# Altium schematic sheet I2C_Switch_EEPROM.SchDoc: I²C Switch & EEPROM
size B; CheckedBy: Jason Sullins; Author: Jordan Harris-Toovy; Revision: 0.2; SheetNumber: 5; SheetTotal: 22; Size: ANSI B
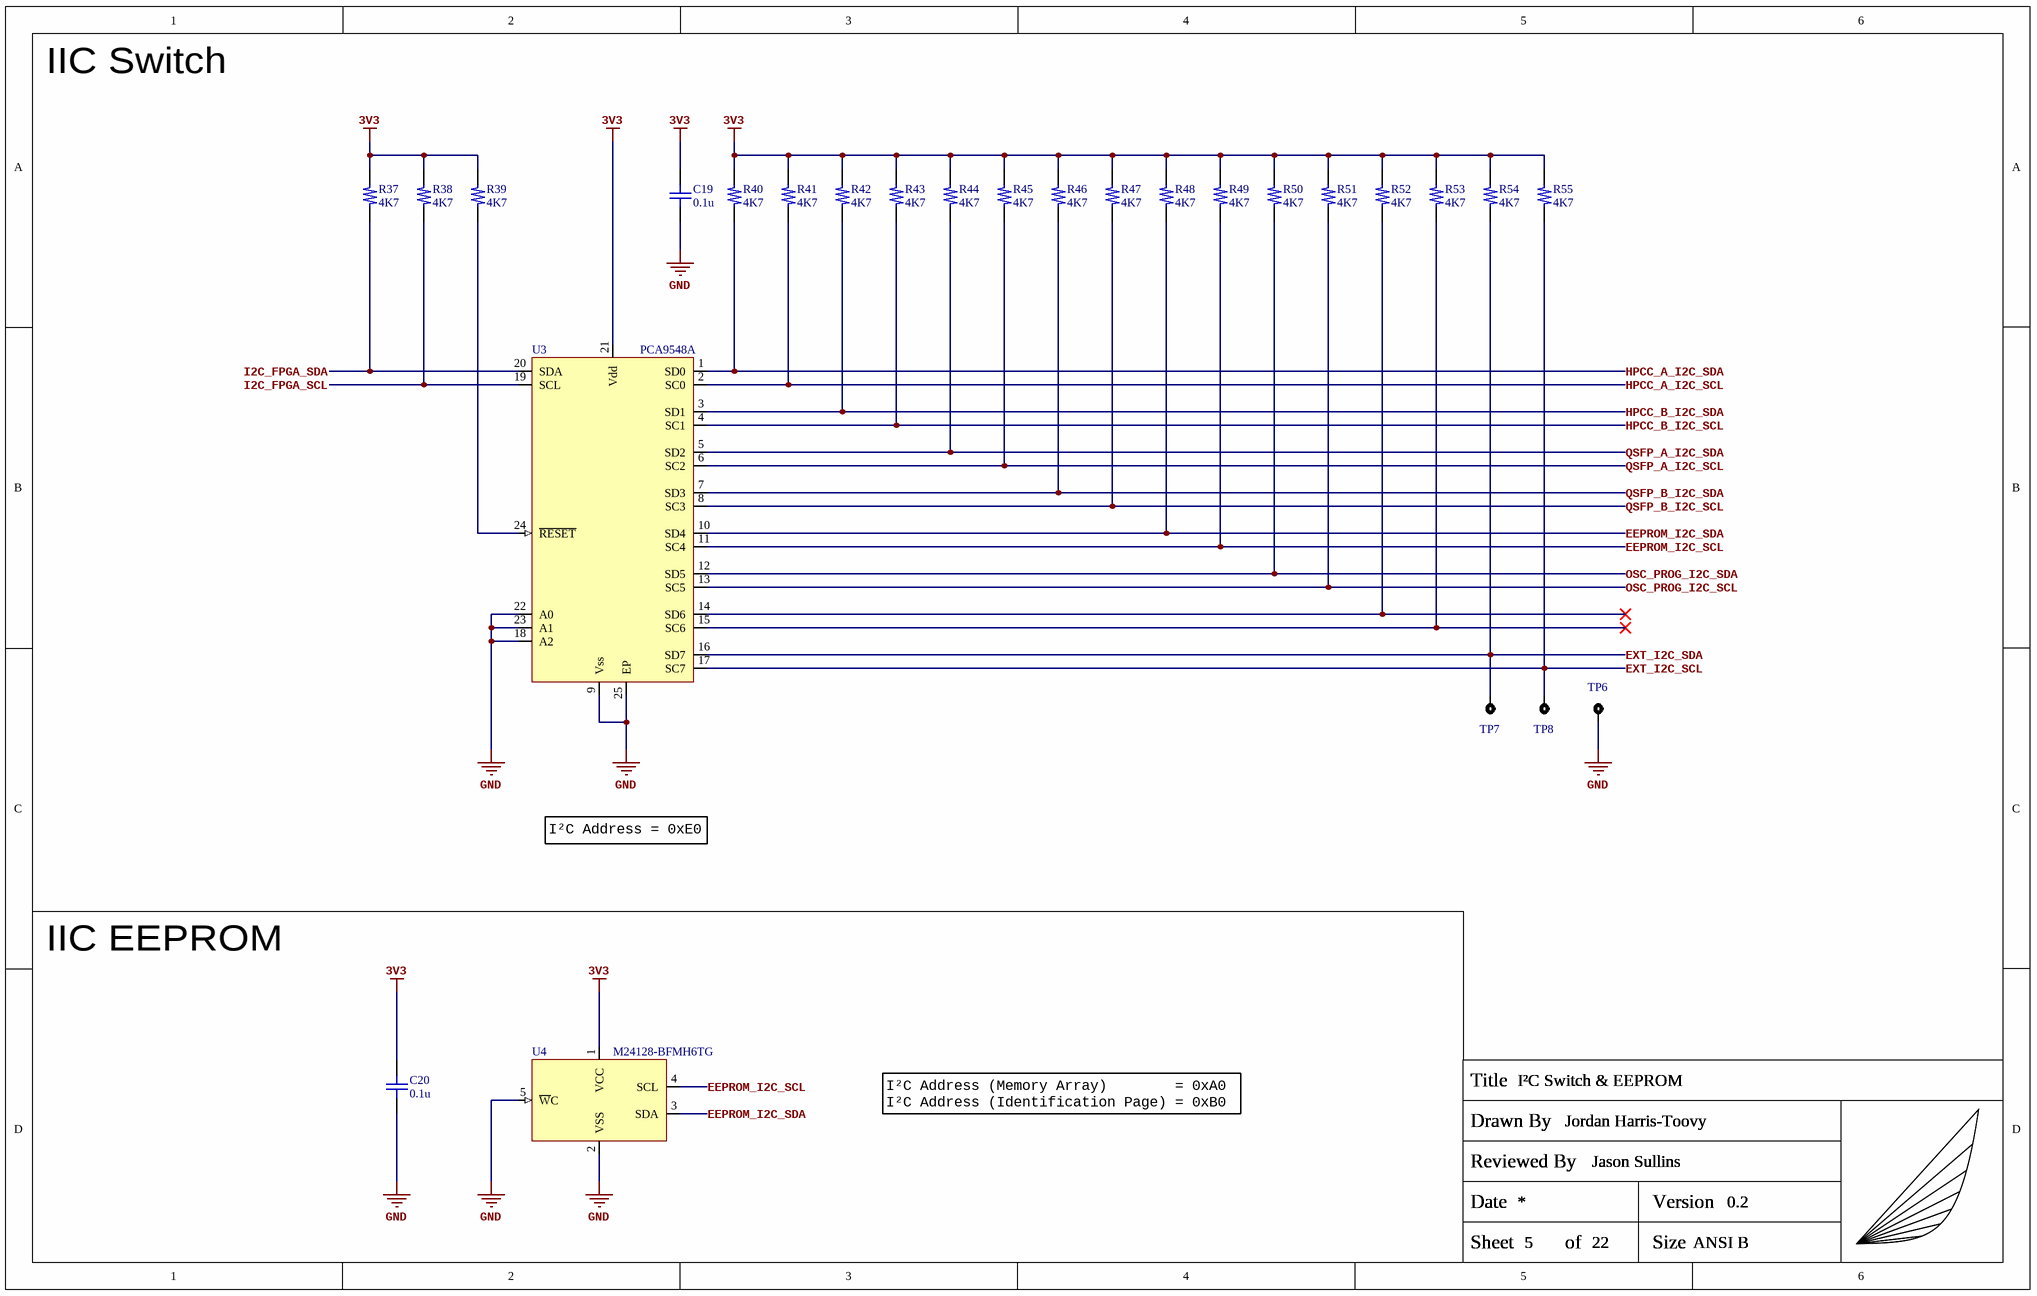
[diagram p0: I2C_Switch_EEPROM.SchDoc]

## Parts
C19  0.1u  [C_0402_Generic]
C20  0.1u  [C_0402_Generic]
R37  4K7  [R_0402_Generic]
R38  4K7  [R_0402_Generic]
R39  4K7  [R_0402_Generic]
R40  4K7  [R_0402_Generic]
R41  4K7  [R_0402_Generic]
R42  4K7  [R_0402_Generic]
R43  4K7  [R_0402_Generic]
R44  4K7  [R_0402_Generic]
R45  4K7  [R_0402_Generic]
R46  4K7  [R_0402_Generic]
R47  4K7  [R_0402_Generic]
R48  4K7  [R_0402_Generic]
R49  4K7  [R_0402_Generic]
R50  4K7  [R_0402_Generic]
R51  4K7  [R_0402_Generic]
R52  4K7  [R_0402_Generic]
R53  4K7  [R_0402_Generic]
R54  4K7  [R_0402_Generic]
R55  4K7  [R_0402_Generic]
TITLEBLOCK?  Capstone_Title_Block  (value not drawn)  (graphical)
TP6  EXT I2C GND Test Point  [TP_3MM]  (value not drawn)
TP7  EXT I2C SDA Test Point  [TP_3MM]  (value not drawn)
TP8  EXT I2C SCL Test Point  [TP_3MM]  (value not drawn)
U3  PCA9548A  [HVQFN24_NXP]
U4  M24128-BFMH6TG  [STM_DFN5]

## Nets
3V3: C19.2 C20.2 R37.2 R38.2 R39.2 R40.2 R41.2 R42.2 R43.2 R44.2 R45.2 R46.2 R47.2 R48.2 R49.2 R50.2 R51.2 R52.2 R53.2 R54.2 R55.2 U3.21(Vdd) U4.1(VCC)
GND: C19.1 C20.1 TP6.1 U3.9(Vss) U3.18(A2) U3.22(A0) U3.23(A1) U3.25(EP) U4.2(VSS) U4.5(~{W}C)
EEPROM_I2C_SCL: R49.1 U3.11(SC4) U4.4(SCL)
EEPROM_I2C_SDA: R48.1 U3.10(SD4) U4.3(SDA)
EXT_I2C_SCL: R55.1 TP8.1 U3.17(SC7)
EXT_I2C_SDA: R54.1 TP7.1 U3.16(SD7)
HPCC_A_I2C_SCL: R41.1 U3.2(SC0)
HPCC_A_I2C_SDA: R40.1 U3.1(SD0)
HPCC_B_I2C_SCL: R43.1 U3.4(SC1)
HPCC_B_I2C_SDA: R42.1 U3.3(SD1)
I2C_FPGA_SCL: R38.1 U3.19(SCL)
I2C_FPGA_SDA: R37.1 U3.20(SDA)
OSC_PROG_I2C_SCL: R51.1 U3.13(SC5)
OSC_PROG_I2C_SDA: R50.1 U3.12(SD5)
QSFP_A_I2C_SCL: R45.1 U3.6(SC2)
QSFP_A_I2C_SDA: R44.1 U3.5(SD2)
QSFP_B_I2C_SCL: R47.1 U3.8(SC3)
QSFP_B_I2C_SDA: R46.1 U3.7(SD3)
NetR39_1: R39.1 U3.24(~{RESET})
NetR52_1: R52.1 U3.14(SD6)
NetR53_1: R53.1 U3.15(SC6)

## Notes on the sheet
- IIC Switch
- I²C Address = 0xE0
- IIC EEPROM
- I²C Address (Memory Array)        = 0xA0
  I²C Address (Identification Page) = 0xB0
- (in symbol Capstone_Title_Block) Title; Drawn By; Reviewed By; Date; Version; Sheet; of; Size

## Library data of the parts
C19 C20 = GRM155R71C104KA88D: 0.1µF 16V X7R SMD ceramic capacitor in 0402 size; Manufacturer: Murata Electronics; Manufacturer Part Number: GRM155R71C104KA88D
R37-R55 = ERJ-2RKF4701X: 4.7KOhm 1% 1/10W SMD resistor in 0402 size; Manufacturer: Panasonic; Manufacturer Part Number: ERJ-2RKF4701X
TITLEBLOCK? = Capstone_Title_Block: Custom title block with personal logo; Manufacturer: NONE; Manufacturer Part Number: NONE
TP6-TP8 = SMD Test Point: SMD Test point 3mm circle; Manufacturer: NONE; Manufacturer Part Number: NONE
U3 = PCA9548ABS,118: 8-channel I 2 C-bus switch, 24-HVQFN; Manufacturer: NXP; Manufacturer Part Number: PCA9548ABS,118
U4 = M24128-BFMH6TG: EEPROM 128Kbit I2C 1MHz 450 ns; Manufacturer: STMicroelectronics; Manufacturer Part Number: M24128-BFMH6TG